# Altium schematic sheet ADS1299.SchDoc
size A
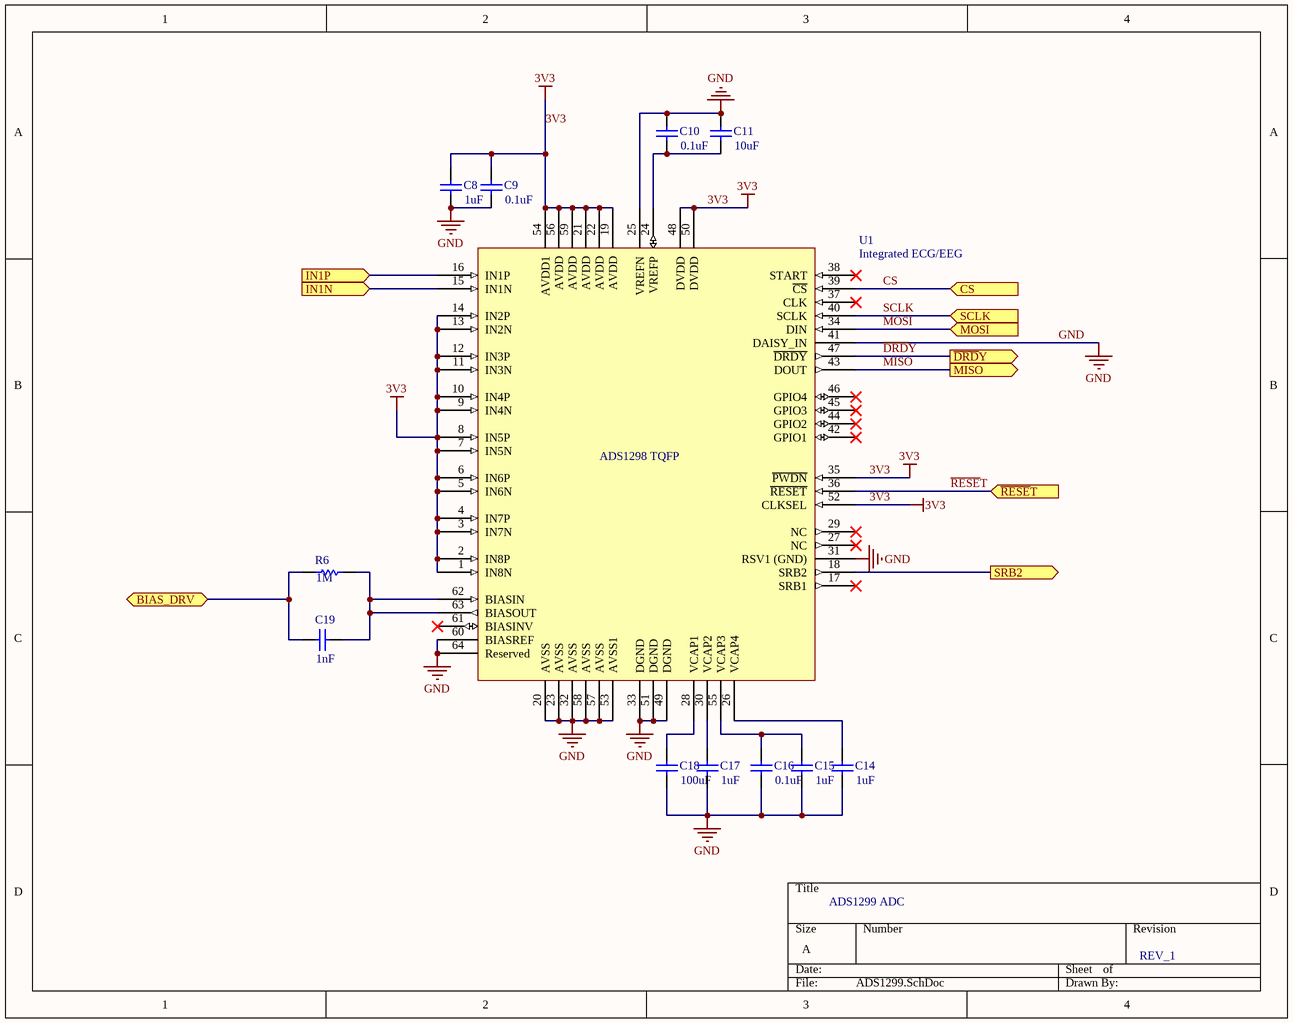
[diagram p0: ADS1299.SchDoc]

## Parts
C8  value 1uF  [1608[0603]]  (hidden comment: Cap)
C9  value 0.1uF  [1608[0603]]  (hidden comment: Cap)
C10  value 0.1uF  [1608[0603]]  (hidden comment: Cap)
C11  value 10uF  [1608[0603]]  (hidden comment: Cap)
C14  value 1uF  [1608[0603]]  (hidden comment: Cap)
C15  value 1uF  [1608[0603]]  (hidden comment: Cap)
C16  value 0.1uF  [1608[0603]]  (hidden comment: Cap)
C17  value 1uF  [1608[0603]]  (hidden comment: Cap)
C18  value 100uF  [1608[0603]]  (hidden comment: Cap)
C19  value 1nF  [1608[0603]]  (hidden comment: Cap)
R6  value 1M  [1608[0603]]  (hidden comment: Res)
U1  Integrated ECG/EEG  [TQFP-PT64_N]

## Ports
BIAS_DRV (bidir), CS (in), IN1N (in), IN1P (in), MISO (out), MOSI (in), SCLK (in), SRB2 (out), ~{DRD}Y (out), ~{RESE}T (in)

## Nets
3V3: C8.2 C9.2 U1.1(IN8N) U1.2(IN8P) U1.3(IN7N) U1.4(IN7P) U1.5(IN6N) U1.6(IN6P) U1.7(IN5N) U1.8(IN5P) U1.9(IN4N) U1.10(IN4P) U1.11(IN3N) U1.12(IN3P) U1.13(IN2N) U1.14(IN2P) U1.19(AVDD) U1.21(AVDD) U1.22(AVDD) U1.35(~{PWDN}) U1.48(DVDD) U1.50(DVDD) U1.52(CLKSEL) U1.54(AVDD1) U1.56(AVDD) U1.59(AVDD)
GND: C8.1 C9.1 C10.2 C11.2 C14.1 C15.1 C16.1 C17.1 C18.1 U1.20(AVSS) U1.23(AVSS) U1.25(VREFN) U1.31(RSV1_(GND)) U1.32(AVSS) U1.33(DGND) U1.41(DAISY_IN) U1.49(DGND) U1.51(DGND) U1.53(AVSS1) U1.57(AVSS) U1.58(AVSS) U1.60(BIASREF) U1.64(Reserved)
BIAS_DRV: C19.2 R6.2 ; port BIAS_DRV
CS: U1.39(~{CS}) ; port CS
~{DRD}Y: U1.47(~{DRDY}) ; port ~{DRD}Y
IN1N: U1.15(IN1N) ; port IN1N
IN1P: U1.16(IN1P) ; port IN1P
MISO: U1.43(DOUT) ; port MISO
MOSI: U1.34(DIN) ; port MOSI
~{RESE}T: U1.36(~{RESET}) ; port ~{RESE}T
SCLK: U1.40(SCLK) ; port SCLK
SRB2: U1.18(SRB2) ; port SRB2
NetC10_1: C10.1 C11.1 U1.24(VREFP)
NetC14_2: C14.2 U1.26(VCAP4)
NetC15_2: C15.2 C16.2 U1.55(VCAP3)
NetC17_2: C17.2 U1.30(VCAP2)
NetC18_2: C18.2 U1.28(VCAP1)
NetC19_1: C19.1 R6.1 U1.62(BIASIN) U1.63(BIASOUT)

Not connected (* = marked no-connect by the designer): U1 17(SRB1)* 27(NC)* 29(NC)* 37(CLK)* 38(START)* 42(GPIO1)* 44(GPIO2)* 45(GPIO3)* 46(GPIO4)* 61(BIASINV)*

## Notes on the sheet
- ADS1299 ADC
- REV_1
- (in symbol ADS1298-TQFP) ADS1298 TQFP

## Library data of the parts
C8-C11 C14-C19 = Cap: Capacitor; Published: 8-Jun-2000; LatestRevisionDate: 17-Jul-2002; LatestRevisionNote: Re-released for DXP Platform.; PackageReference: RAD-0.3; Publisher: Altium Limited; PackageDescription: Radial Cap, Thru-Hole; 2 Leads; 0.3 in Pin Spacing
R6 = Res1: Resistor; Published: 8-Jun-2000; LatestRevisionDate: 17-Jul-2002; LatestRevisionNote: Re-released for DXP Platform.; PackageReference: AXIAL-0.3; Publisher: Altium Limited; PackageDescription: Axial Device, Thru-Hole; 2 Leads; 0.3 in Pin Spacing
U1 = ADS1298-TQFP